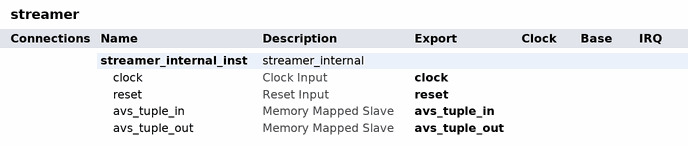
[diagram p0: system contents]
# Platform Designer (Qsys) system streamer, Cyclone V 5CGXFC7C7F23C8
# Parameters at their usual value, and those the tool derives, are not listed.
package require qsys
create_system streamer
set_project_property DEVICE_FAMILY {Cyclone V}
set_project_property DEVICE 5CGXFC7C7F23C8

add_instance streamer_internal_inst streamer_internal 1.0
set_instance_property streamer_internal_inst AUTO_EXPORT true

# exported interfaces
add_interface avs_tuple_in avalon slave
set_interface_property avs_tuple_in EXPORT_OF streamer_internal_inst.avs_tuple_in
add_interface avs_tuple_out avalon slave
set_interface_property avs_tuple_out EXPORT_OF streamer_internal_inst.avs_tuple_out
add_interface clock clock sink
set_interface_property clock EXPORT_OF streamer_internal_inst.clock
add_interface reset reset sink
set_interface_property reset EXPORT_OF streamer_internal_inst.reset

set_interconnect_requirement {$system} qsys_mm.clockCrossingAdapter HANDSHAKE
set_interconnect_requirement {$system} qsys_mm.enableEccProtection FALSE
set_interconnect_requirement {$system} qsys_mm.insertDefaultSlave FALSE
set_interconnect_requirement {$system} qsys_mm.maxAdditionalLatency 1

save_system streamer.qsys
